# EAGLE design d11toy2d (EAGLE 6.6.0)
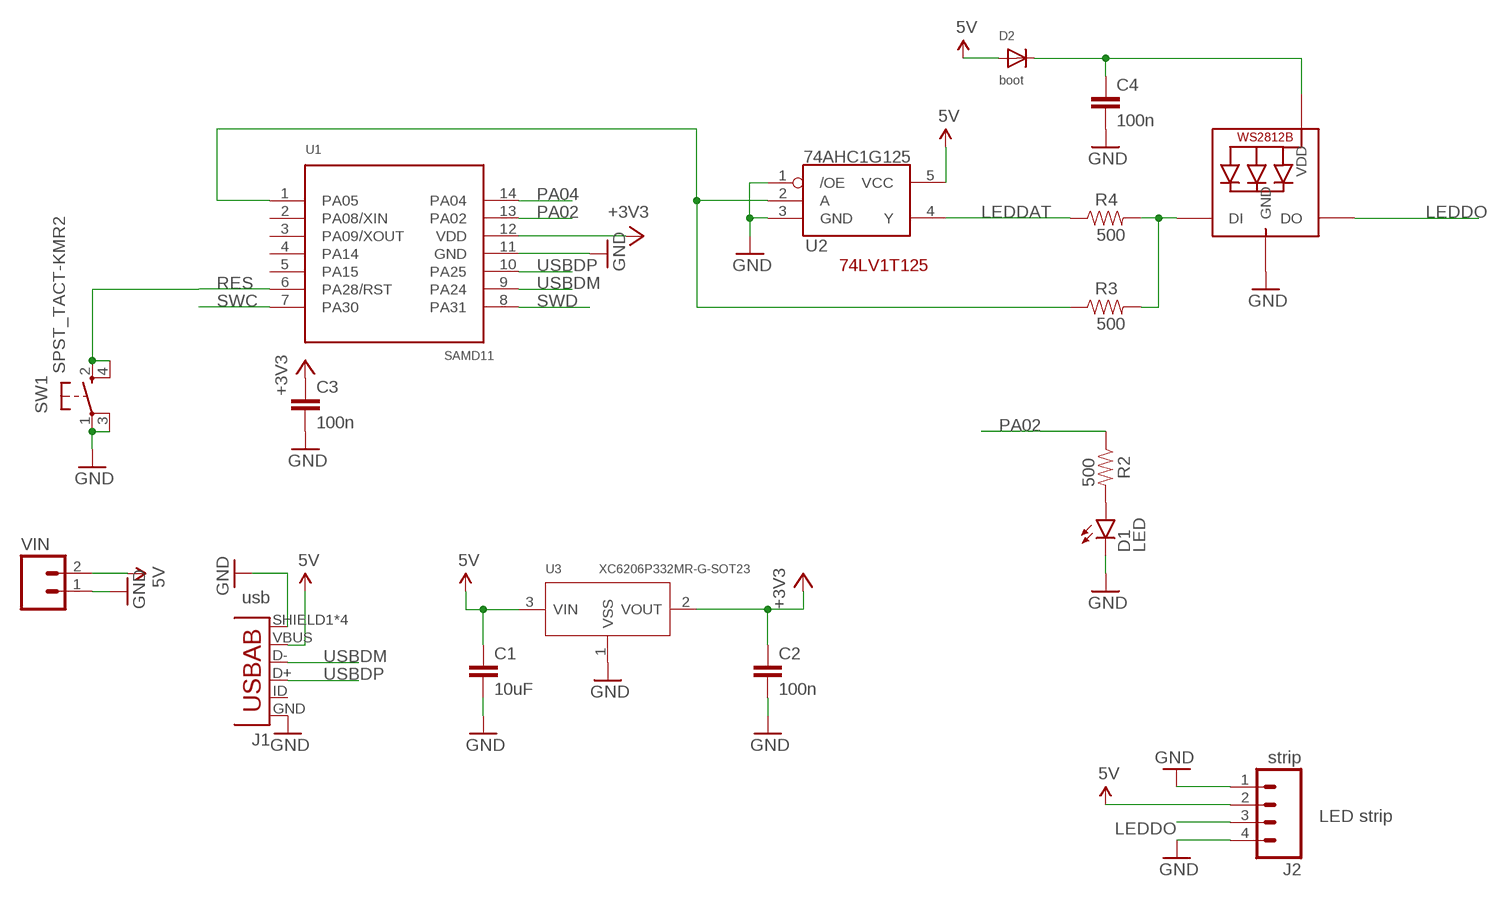
[diagram p0: schematic, sheet 1]

## Parts
C1  10uF  CAP0603-CAP  [0603-CAP]
C2  100n  CAP0603-CAP  [0603-CAP]
C3  100n  CAP0603-CAP  [0603-CAP]
C4  100n  CAP0603-CAP  [0603-CAP]
D1  LED  LED0603  [LED-0603]
D2  boot  DIODESOD-523  [SOD-523]
J1  usb  USB-AB  [USB-AB-MICRO-SMD]
J2  strip  M04NO_SILK_ALL_ROUND  [1X04_NO_SILK_ALL_ROUND]
LED1  WS2812B5050  [WS2812B]
R2  500  RESISTOR0603-RES  [0603-RES]
R3  500  RESISTOR0603-RES  [0603-RES]
R4  500  RESISTOR0603-RES  [0603-RES]
SW1  SPST_TACT-KMR2  [KMR2]
U1  SAMD11  SAMD11C14  [SO14]
U2  74AHC1G125  [SOT23-5]
U3  XC6206P332MR-G-SOT23  PMIC-LDO-XC6206P332MR-G(SOT23)  [SOT-23]
VIN  M02PTH  [1X02]

## Nets
5V: C1.1 D2.A J1.VBUS J2.2 U2.5(VCC) U3.3(VIN) VIN.2
+3V3: C2.1 C3.1 U1.12(VDD) U3.2(VOUT)
GND: C1.2 C2.2 C3.2 C4.2 D1.C J1.GND J1.SHIELD1(SHIELD) J1.SHIELD2(SHIELD) J1.SHIELD3(SHIELD) J1.SHIELD4(SHIELD) J2.1 J2.4 LED1.3-GND(GND) SW1.1(P) SW1.3(P1) U1.11(GND) U2.1(/OE) U2.3(GND) U3.1(VSS) VIN.1
LEDDAT: R4.1 U2.4(Y)
LEDDAT3V3: R3.1 U1.1(PA05) U2.2(A)
LEDDO: J2.3 LED1.2-DOUT(DO)
N$1: D1.A R2.2
N$3: C4.1 D2.K(C) LED1.1-VDD(VDD)
N$5: LED1.4-DIN(DI) R3.2 R4.2
PA02: R2.1 U1.13(PA02)
PA04: U1.14(PA04)
RES: SW1.2(S) SW1.4(S1) U1.6(PA28/RST)
SWC: U1.7(PA30)
SWD: U1.8(PA31)
USBDM: J1.D- U1.9(PA24)
USBDP: J1.D+ U1.10(PA25)
Unconnected: J1.ID(USBID) U1.2(PA08/XIN) U1.3(PA09/XOUT) U1.4(PA14) U1.5(PA15)

## Notes on the sheet
- 74LV1T125
- LED strip

## Library data of the parts
C1-C4 = SparkFun-Capacitors:CAP: Capacitor Standard 0603 ceramic capacitor, and 0.1" leaded capacitor.
D1 = SparkFun-LED:LED: LEDs Standard schematic elements and footprints for 5mm, 3mm, 1206, and 0603 sized LEDs. 5mm - Spark Fun Electronics SKU : COM-00529 (and others)
D2 = adafruit:DIODE: Diode SMADIODE - SMA Surface Mount Package 20V 1A Schottky Diode Digikey: 641-1014-6-ND DO-1N4148 - Through Hole Small Current Diode SOD-123 20V 1 A (.5mV Vf) Schottky Diode - Digikey: MBRX120TPMSCT-ND SOD-323 10V 570mA (.38mV Vf, 3ns) Schottky Diode - Digikey: ZLLS410CT-ND SOD-523 30V 30mA Schottky Diode (RB751S-40TE61) - Digikey: RB751S-40TE61CT-ND SOT23-R/W - SOT23 Package (R = Solder Paste/Reflow Ovens, W = Hand-Soldering) BAT54Film 40V 300mA - Digikey: 497-7162-1-ND
J1 = SparkFun-Connectors:USB-AB: This is a USB AB connector that is compatible with USB OTG. i.e. this connector can serve as a host or device
J2 = SparkFun-Connectors:M04: Header 4 Standard 4-pin 0.1" header. Use with straight break away headers (SKU : PRT-00116), right angle break away headers (PRT-00553), swiss pins (PRT-00743), machine pins (PRT-00117), and female headers (PRT-00115). Molex polarized connector foot print use with SKU : PRT-08231 with associated crimp pins and housings. 1MM SMD Version SKU: PRT-10208; PROD_ID: CONN-09696
LED1 = adafruit:WS2812B
R2-R4 = SparkFun-Passives:RESISTOR: Resistor Basic schematic elements and footprints for 0603, 1206, and PTH resistors.
SW1 = adafruit:SPST_TACT: SMT 6mm switch, EVQQ2 series http://www.ladyada.net/library/eagle
U1 = todstuff:SAMD11C14: ATSAMD11C14A-SS - SAMD11 14-pin SOIC
U2 = SparkFun-DigitalIC:74AHC1G125: Single bus buffer gate with 3-state output; PROD_ID: IC-11920
U3 = Seeed-IC-2016:PMIC-LDO-XC6206P332MR-G(SOT23): 310030099; MPN: XC6206P332MR-G
VIN = SparkFun-Connectors:M02: Standard 2-pin 0.1" header. Use with - straight break away headers ( PRT-00116) - right angle break away headers (PRT-00553) - swiss pins (PRT-00743) - machine pins (PRT-00117) - female headers (PRT-00115) Molex polarized connector foot print use with: PRT-08233 with associated crimp pins and housings. 2.54_SCREWTERM for use with PRT-10571. 3.5mm Screw Terminal footprints for PRT-08084 5mm Screw Terminal footprints for use with PRT-08432

## Board
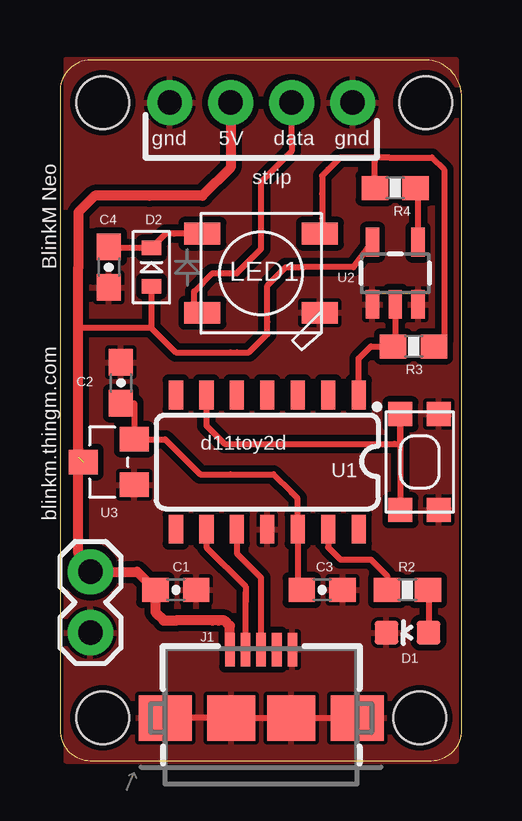
[diagram p1: board, top side]
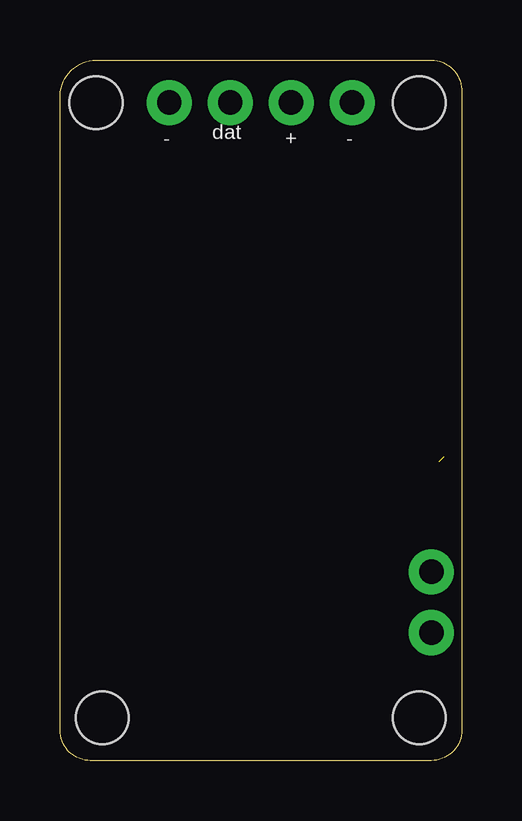
[diagram p2: board, bottom side, seen from below]

Size 16.74 x 29.21 mm. Coordinates in mm from the lower left corner, seen from the top.
Outline: 0,27.86 0,1.27 arc90 1.27,0 15.47,0 arc90 16.74,1.27 16.74,27.61 arc90 15.24,29.21 1.27,29.21 arc90 0,27.86
Copper layers (1*16): Top 0.035mm / dielectric 1.5mm / Bottom 0.035mm
Design rules "OthermillDRC_30_deg_v2": minimum track width 6mil, minimum drill 0.8mm, track to track 6mil, track to pad 6mil, pad to pad 6mil, via to via 6mil, smd to smd 0mil, copper to edge 0mil, drill to drill 6mil, minimum pad ring 10mil, minimum via ring 10mil, stop-mask expansion 1mil, vias tented up to drill 30mil, thermal gap 6mil
Holes 2.2 mm at 14.99,1.78 15.24,27.43 1.78,1.78 1.78,27.43

### Footprints (pad centres in the part's own frame; a part is rotated, then mirrored left to right if it is on the bottom)
0603-CAP = smd 1.1 x 1: 1 -0.85,0; 2 0.85,0
LED-0603 = smd 1 x 1: A 0,-0.877; C 0,0.877
SOD-523 = smd 0.8 x 0.6: A 0,-0.8; K 0,0.8
USB-AB-MICRO-SMD = smd 1.4 x 0.4: D+ 2.85,0; D- 2.85,0.65; GND 2.85,-1.3; ID 2.85,-0.65; VBUS 2.85,1.3 | smd 1.9 x 2.2: SHIELD1 0,4; SHIELD4 0,-4 | smd 1.9 x 2: SHIELD2 0,1.25; SHIELD3 0,-1.25
1X04_NO_SILK_ALL_ROUND = drill 1.016 pad 1.88: 1 0,0; 2 2.54,0; 3 5.08,0; 4 7.62,0
WS2812B = smd 1.5 x 0.9: 1-VDD 2.45,-1.65; 2-DOUT 2.45,1.65; 3-GND -2.45,1.65; 4-DIN -2.45,-1.65
0603-RES = smd 1.1 x 1: 1 -0.85,0; 2 0.85,0
KMR2 = smd 1 x 1: 1 2,0.8; 2 2,-0.8; 3 -2,0.8; 4 -2,-0.8
SO14 = smd 0.6 x 1.2: 1 -3.81,-2.8; 2 -2.54,-2.8; 3 -1.27,-2.8; 4 0,-2.8; 5 1.27,-2.8; 6 2.54,-2.8; 7 3.81,-2.8; 8 3.81,2.8; 9 2.54,2.8; 10 1.27,2.8; 11 0,2.8; 12 -1.27,2.8; 13 -2.54,2.8; 14 -3.81,2.8
SOT23-5 = smd 0.55 x 1.2: 1 -0.95,-1.3; 2 0,-1.3; 3 0.95,-1.3; 4 0.95,1.3; 5 -0.95,1.3
SOT-23 = smd 1.016 x 1.2: 1 -0.95,-1.06; 2 0.95,-1.06; 3 0,1.06
1X02 = drill 1.016 pad 1.88: 1 0,0; 2 2.54,0

### Placement (x,y rotation side)
C1  4.83,7.11 0 top
C2  2.54,15.75 90 top
C3  10.92,7.11 0 top
C4  2.03,20.57 270 top
D1  14.48,5.33 90 top
D2  3.81,20.57 0 top
J1  8.38,1.78 90 top
J2  4.57,27.43 0 top
LED1  8.38,20.32 180 top
R2  14.48,7.11 0 top
R3  14.73,17.27 0 top
R4  13.97,23.88 180 top
SW1  14.99,12.45 270 top
U1  8.64,12.45 180 top
U2  13.97,20.32 0 top
U3  2.03,12.45 90 top
VIN  1.27,5.33 90 top

### Tracks (layer width: path | path; a pad name or v marks a point on that pad's centre or on a via)
5V  (1 unrouted)
  Top 0.254: 3.81,18.03 0.76,18.03 | U2.5 12.23,20.57 10.16,20.57 9.4,20.57 8.64,19.81 8.64,18.29 8.64,17.78 7.87,17.02 7.37,17.02 7.11,17.02 4.83,17.02 3.81,18.03 | D2.A 3.81,18.03
  Top 0.406: J1.VBUS 7.08,5.62 6.86,5.84 6.6,5.84 6.35,5.84 4.83,5.84 4.32,5.84 3.98,6.18 C1.1 3.21,7.87 VIN.2 0.76,8.64 0.76,12.95 | J2.2 7.11,24.73 5.93,23.55 3.73,23.55 1.45,23.55 0.76,22.86 0.76,21.59 0.76,20.57 0.76,18.03 0.76,12.95 | 0.76,12.66 0.76,12.95
  pour Top: -3.81,22.86 -6.35,22.86 -6.35,0 -3.81,0
+3V3
  Top 0.254: C2.1 3.09,14.9 U3.2 4.38,13.4 5.84,11.94 7.11,11.94 8.89,11.94 9.65,11.18 9.91,10.92 U1.12 9.91,7.2 C3.1
GND
  Top 0.254: J1.SHIELD4 J1.SHIELD3 J1.SHIELD2 J1.SHIELD1
  pour Top (isolate 0.254): 16.51,29.21 0.25,29.21 0.25,0 16.51,0
LEDDAT
  Top 0.254: U2.4 14.92,23.78 R4.1
LEDDAT3V3
  Top 0.254: 13.56,16.93 R3.1 | U2.2 13.97,17.36 R3.1 | U1.1 12.45,16.76 12.7,17.02 12.95,17.27 R3.1
LEDDO
  Top 0.254: J2.3 9.65,25.91 9.65,25.4 8.38,24.13 8.38,21.34 7.37,20.32 6.35,20.32 5.59,19.56 5.59,19.01 LED1.2-DOUT
N$1
  Top 0.254: R2.2 15.36,7.08 D1.A
N$3
  Top 0.254: LED1.1-VDD 4.76,21.97 4.41,21.97 D2.K 2.08,21.37 C4.1
N$5
  Top 0.254: 11.09,22.19 LED1.4-DIN 10.92,22.06 10.92,22.61 10.92,23.62 10.92,24.38 11.18,24.64 11.68,25.15 12.45,25.15 12.95,25.15 13.21,25.15 | R3.2 15.75,17.27 16,17.53 16,24.64 15.49,25.15 13.72,25.15 13.21,25.15 | R4.2 13.12,24.98 13.12,25.15 13.21,25.15
PA02
  Top 0.254: U1.13 11.18,8.89 11.68,8.38 12.95,8.38 13.46,7.87 13.63,7.71 R2.1
RES
  Top 0.254: U1.6 6.1,13.97 6.86,13.21 13.93,13.21 14.19,13.21 SW1.4 SW1.2
USBDM
  Top 0.254: J1.D- 7.73,6.6 | 7.73,6.6 7.73,7 | 7.73,6.6 7.73,7.25 6.1,8.89 U1.9
USBDP
  Top 0.254: J1.D+ 8.38,7.62 7.87,8.13 7.37,8.64 7.37,9.4 U1.10

### Text on the board
tPlace: gnd | 5V | data | gnd | BlinkM Neo | strip | blinkm.thingm.com | d11toy2d
bPlace: - | + | dat | -